# Altium schematic sheet address_LEDs.SchDoc
size A4; SheetNumber: 3; SheetTotal: 5
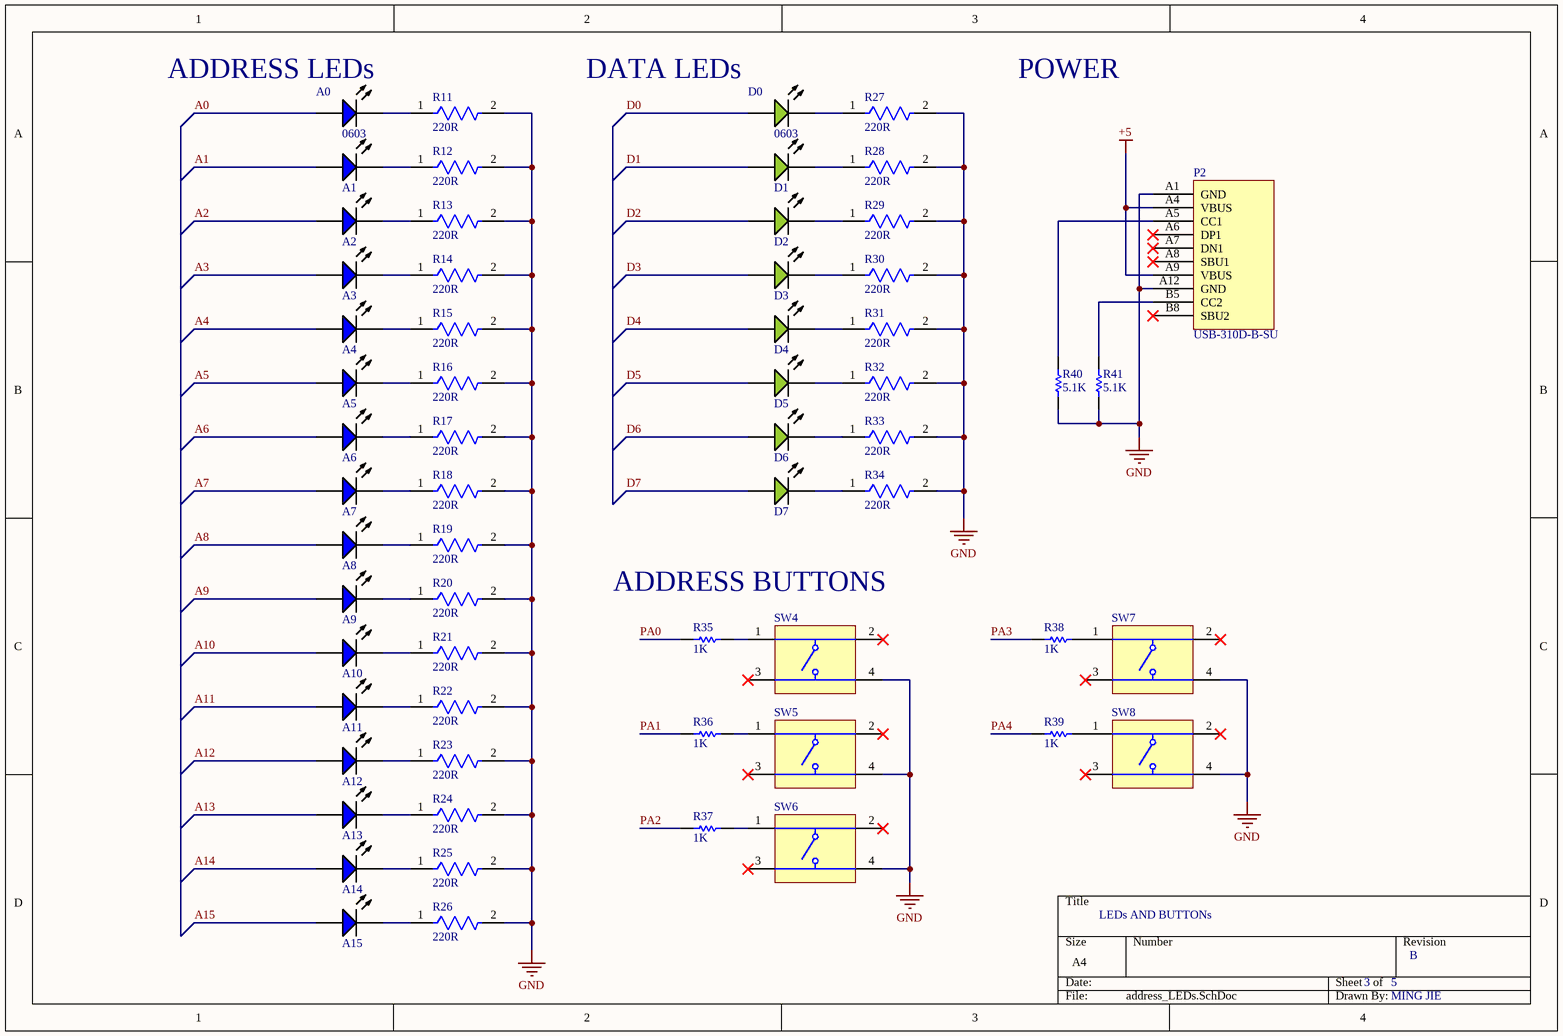
[diagram p0: address_LEDs.SchDoc]

## Parts
A0  Package Reference: 0603  [EVRL-0603-2_V]  (hidden comment: 19-217/BHC-ZL1M2RY/3T)
A1  19-217/BHC-ZL1M2RY/3T  [EVRL-0603-2_V]  (value not drawn)
A2  19-217/BHC-ZL1M2RY/3T  [EVRL-0603-2_V]  (value not drawn)
A3  19-217/BHC-ZL1M2RY/3T  [EVRL-0603-2_V]  (value not drawn)
A4  19-217/BHC-ZL1M2RY/3T  [EVRL-0603-2_V]  (value not drawn)
A5  19-217/BHC-ZL1M2RY/3T  [EVRL-0603-2_V]  (value not drawn)
A6  19-217/BHC-ZL1M2RY/3T  [EVRL-0603-2_V]  (value not drawn)
A7  19-217/BHC-ZL1M2RY/3T  [EVRL-0603-2_V]  (value not drawn)
A8  19-217/BHC-ZL1M2RY/3T  [EVRL-0603-2_V]  (value not drawn)
A9  19-217/BHC-ZL1M2RY/3T  [EVRL-0603-2_V]  (value not drawn)
A10  19-217/BHC-ZL1M2RY/3T  [EVRL-0603-2_V]  (value not drawn)
A11  19-217/BHC-ZL1M2RY/3T  [EVRL-0603-2_V]  (value not drawn)
A12  19-217/BHC-ZL1M2RY/3T  [EVRL-0603-2_V]  (value not drawn)
A13  19-217/BHC-ZL1M2RY/3T  [EVRL-0603-2_V]  (value not drawn)
A14  19-217/BHC-ZL1M2RY/3T  [EVRL-0603-2_V]  (value not drawn)
A15  19-217/BHC-ZL1M2RY/3T  [EVRL-0603-2_V]  (value not drawn)
D0  Package Reference: 0603  [EVRL-0603-2_V]  (hidden comment: 19-217/GHC-YR1S2/3T)
D1  19-217/GHC-YR1S2/3T  [EVRL-0603-2_V]  (value not drawn)
D2  19-217/GHC-YR1S2/3T  [EVRL-0603-2_V]  (value not drawn)
D3  19-217/GHC-YR1S2/3T  [EVRL-0603-2_V]  (value not drawn)
D4  19-217/GHC-YR1S2/3T  [EVRL-0603-2_V]  (value not drawn)
D5  19-217/GHC-YR1S2/3T  [EVRL-0603-2_V]  (value not drawn)
D6  19-217/GHC-YR1S2/3T  [EVRL-0603-2_V]  (value not drawn)
D7  19-217/GHC-YR1S2/3T  [EVRL-0603-2_V]  (value not drawn)
P2  USB-310D-B-SU  [USB-C-THT]
R11  Resistance: 220R  [FP-CRCW0805-e3-MFG]  (hidden comment: CRCW0805220RFKEA)
R12  Resistance: 220R  [FP-CRCW0805-e3-MFG]  (hidden comment: CRCW0805220RFKEA)
R13  Resistance: 220R  [FP-CRCW0805-e3-MFG]  (hidden comment: CRCW0805220RFKEA)
R14  Resistance: 220R  [FP-CRCW0805-e3-MFG]  (hidden comment: CRCW0805220RFKEA)
R15  Resistance: 220R  [FP-CRCW0805-e3-MFG]  (hidden comment: CRCW0805220RFKEA)
R16  Resistance: 220R  [FP-CRCW0805-e3-MFG]  (hidden comment: CRCW0805220RFKEA)
R17  Resistance: 220R  [FP-CRCW0805-e3-MFG]  (hidden comment: CRCW0805220RFKEA)
R18  Resistance: 220R  [FP-CRCW0805-e3-MFG]  (hidden comment: CRCW0805220RFKEA)
R19  Resistance: 220R  [FP-CRCW0805-e3-MFG]  (hidden comment: CRCW0805220RFKEA)
R20  Resistance: 220R  [FP-CRCW0805-e3-MFG]  (hidden comment: CRCW0805220RFKEA)
R21  Resistance: 220R  [FP-CRCW0805-e3-MFG]  (hidden comment: CRCW0805220RFKEA)
R22  Resistance: 220R  [FP-CRCW0805-e3-MFG]  (hidden comment: CRCW0805220RFKEA)
R23  Resistance: 220R  [FP-CRCW0805-e3-MFG]  (hidden comment: CRCW0805220RFKEA)
R24  Resistance: 220R  [FP-CRCW0805-e3-MFG]  (hidden comment: CRCW0805220RFKEA)
R25  Resistance: 220R  [FP-CRCW0805-e3-MFG]  (hidden comment: CRCW0805220RFKEA)
R26  Resistance: 220R  [FP-CRCW0805-e3-MFG]  (hidden comment: CRCW0805220RFKEA)
R27  Resistance: 220R  [FP-CRCW0805-e3-MFG]  (hidden comment: CRCW0805220RFKEA)
R28  Resistance: 220R  [FP-CRCW0805-e3-MFG]  (hidden comment: CRCW0805220RFKEA)
R29  Resistance: 220R  [FP-CRCW0805-e3-MFG]  (hidden comment: CRCW0805220RFKEA)
R30  Resistance: 220R  [FP-CRCW0805-e3-MFG]  (hidden comment: CRCW0805220RFKEA)
R31  Resistance: 220R  [FP-CRCW0805-e3-MFG]  (hidden comment: CRCW0805220RFKEA)
R32  Resistance: 220R  [FP-CRCW0805-e3-MFG]  (hidden comment: CRCW0805220RFKEA)
R33  Resistance: 220R  [FP-CRCW0805-e3-MFG]  (hidden comment: CRCW0805220RFKEA)
R34  Resistance: 220R  [FP-CRCW0805-e3-MFG]  (hidden comment: CRCW0805220RFKEA)
R35  Resistance: 1K  [RESC2013X50X30NL20T20]  (hidden comment: CRCW08051K00FKEA)
R36  Resistance: 1K  [RESC2013X50X30NL20T20]  (hidden comment: CRCW08051K00FKEA)
R37  Resistance: 1K  [RESC2013X50X30NL20T20]  (hidden comment: CRCW08051K00FKEA)
R38  Resistance: 1K  [RESC2013X50X30NL20T20]  (hidden comment: CRCW08051K00FKEA)
R39  Resistance: 1K  [RESC2013X50X30NL20T20]  (hidden comment: CRCW08051K00FKEA)
R40  Resistance: 5.1K  [RESC2013X50X30NL20T20]  (hidden comment: 0805W8F5101T5E)
R41  Resistance: 5.1K  [RESC2013X50X30NL20T20]  (hidden comment: 0805W8F5101T5E)
SW4  K2-1102SP-C4SC-04  [TECO-FSM4JSMA_V]  (value not drawn)
SW5  K2-1102SP-C4SC-04  [TECO-FSM4JSMA_V]  (value not drawn)
SW6  K2-1102SP-C4SC-04  [TECO-FSM4JSMA_V]  (value not drawn)
SW7  K2-1102SP-C4SC-04  [TECO-FSM4JSMA_V]  (value not drawn)
SW8  K2-1102SP-C4SC-04  [TECO-FSM4JSMA_V]  (value not drawn)

## Nets
+5: P2.A4(VBUS) P2.A9(VBUS)
GND: P2.A1(GND) P2.A12(GND) R11.2 R12.2 R13.2 R14.2 R15.2 R16.2 R17.2 R18.2 R19.2 R20.2 R21.2 R22.2 R23.2 R24.2 R25.2 R26.2 R27.2 R28.2 R29.2 R30.2 R31.2 R32.2 R33.2 R34.2 R40.1 R41.1 SW4.4 SW5.4 SW6.4 SW7.4 SW8.4
A0: A0.1(A)
A1: A1.1(A)
A2: A2.1(A)
A3: A3.1(A)
A4: A4.1(A)
A5: A5.1(A)
A6: A6.1(A)
A7: A7.1(A)
A8: A8.1(A)
A9: A9.1(A)
A10: A10.1(A)
A11: A11.1(A)
A12: A12.1(A)
A13: A13.1(A)
A14: A14.1(A)
A15: A15.1(A)
D0: D0.1(A)
D1: D1.1(A)
D2: D2.1(A)
D3: D3.1(A)
D4: D4.1(A)
D5: D5.1(A)
D6: D6.1(A)
D7: D7.1(A)
PA0: R35.1
PA1: R36.1
PA2: R37.1
PA3: R38.1
PA4: R39.1
NetA0_2: A0.2(K) R11.1
NetA1_2: A1.2(K) R12.1
NetA2_2: A2.2(K) R13.1
NetA3_2: A3.2(K) R14.1
NetA4_2: A4.2(K) R15.1
NetA5_2: A5.2(K) R16.1
NetA6_2: A6.2(K) R17.1
NetA7_2: A7.2(K) R18.1
NetA8_2: A8.2(K) R19.1
NetA9_2: A9.2(K) R20.1
NetA10_2: A10.2(K) R21.1
NetA11_2: A11.2(K) R22.1
NetA12_2: A12.2(K) R23.1
NetA13_2: A13.2(K) R24.1
NetA14_2: A14.2(K) R25.1
NetA15_2: A15.2(K) R26.1
NetD0_2: D0.2(K) R27.1
NetD1_2: D1.2(K) R28.1
NetD2_2: D2.2(K) R29.1
NetD3_2: D3.2(K) R30.1
NetD4_2: D4.2(K) R31.1
NetD5_2: D5.2(K) R32.1
NetD6_2: D6.2(K) R33.1
NetD7_2: D7.2(K) R34.1
NetP2_A5: P2.A5(CC1) R40.2
NetP2_B5: P2.B5(CC2) R41.2
NetR35_2: R35.2 SW4.1
NetR36_2: R36.2 SW5.1
NetR37_2: R37.2 SW6.1
NetR38_2: R38.2 SW7.1
NetR39_2: R39.2 SW8.1

Not connected (* = marked no-connect by the designer): P2 A6(DP1)* A7(DN1)* A8(SBU1)* B8(SBU2)*; SW4 2* 3*; SW5 2* 3*; SW6 2* 3*; SW7 2* 3*; SW8 2* 3*

## Notes on the sheet
- (near A0) ADDRESS LEDs
- DATA LEDs
- POWER
- ADDRESS BUTTONS
- LEDs AND BUTTONs
- 3
- 5
- B
- MING JIE

## Library data of the parts
A0-A15 = CMP-2100-03577-1: Chip LED, Blue, 5 V, 25 mA, -40 to 85 degC, 2-Pin SMD (0603), RoHS, Tape and Reel; Manufacturer: Everlight Electronics; Test Current: 20mA; Number of LEDs: 1; Luminous Intensity: 28.5mcd; Lens Style: Rectangular; Forward Current: 25mA; Power Dissipation: 110W; Forward Voltage: 3V; Viewing Angle: 120degrees; Dominant Wavelength: 470nm; Max Operating Temperature: 85degC; Mount: SurfaceMount; Package Description: 2-Pin Surface Mount Device, Body 1.6 x 0.8 mm; Depth: 0.8mm; Packaging: TapeandReel; Length: 1.6mm; Radiation Hardening: No; Colour: Blue; Datasheet Version: Rev. 1.0, 03/2003; Min Operating Temperature: -40degC; Number of Elements: 1; Manufacturer URL: http://www.everlight.com/; Datasheet URL: https://datasheet.ciiva.com/26901/getdatasheetpartid-420616-26901324.pdf; Case/Package: SMD/SMT; Lead Free: LeadFree; RoHSCompliant: true; Number of Pins: 2
  A1-A15: Package Reference: 0603
D0-D7 = CMP-2100-03580-1: Green 520~535nm 0603 Light Emitting Diodes (LED) RoHS; Manufacturer: Everlight Electronics; Lens Style: Rectangular; Forward Voltage: 2V; Number of LEDs: 1; Viewing Angle: 120degrees; Colour: Green; RoHSCompliant: true; Datasheet URL: https://datasheet.ciiva.com/48679/19-217-g7c-an1p2-3t-48679179.pdf; Manufacturer URL: http://www.everlight.com/; Package Description: 2-Pin Surface Mount Device, Body 1.6 x 0.8 mm; Datasheet Version: Rev. 1, 04/2006; Mount: SurfaceMount; Lead Free: LeadFree; Number of Pins: 2
  D1-D7: Package Reference: 0603
P2 = USB-310D-B-SU: USB Type C Receptacle
R11-R34 = CMP-2001-03682-2: RES Thick Film, 220Ω, 1%, 0.125W, 100ppm/°C, 0805; Max Power Dissipation: 125mW; Voltage Rating: 150V; Packaging: Tape and Reel; Termination: SMD/SMT; Height: 0.45mm; Package Quantity: 10; Width: 0.049inch; Min Operating Temperature: -55°C; Lead Free: Lead Free; Military Standard: Not; Mount: Surface Mount; Max Operating Temperature: 155°C; Voltage Rating (DC): 150V; Composition: Thick Film; Case/Package: 0805; Length: 2mm; Weight: 0.000194oz; Case Code (Metric): 2012; Number of Terminations: 2; Case Code (Imperial): 0805; Radiation Hardening: No; Tolerance: 1%; Features: Automotive AEC-Q200; Power Rating: 125mW; Depth: 1.25mm; Contact Plating: Tin; Temperature Coefficient: 100ppm/°C
R35-R39 = CMP-1013-00510-2: Manufacturer: Vishay Dale; Part Number: CRCW08051K00FKEA
R40 R41 = CMP-1013-00510-2: 5.1kΩ ±1% 0.125W ±100ppm/℃ 0805 Chip Resistor - Surface Mount RoHS; Manufacturer: UniOhm; Part Number: 0805W8F5101T5E
SW4-SW8 = CMP-2000-05602-2: Swicth, SPST, 24 V, -35 to 85 degC, 4-Pin SMD, RoHS, Tape and Reel; Manufacturer: TE Connectivity; Switch Travel: 0.25mm; Mechanical Life: 100000Cycles; Contact Current Rating: 50mA; Operating Force: 1.57N; Actuator Material: Polyamide; Contact Resistance: 100mOhm; Voltage Rating: 24V; Illumination Type: Illuminated; Actuator Length: 0.055inch; Max Voltage Rating (DC): 12V; Case\/Package: SMD/SMT; Orientation: Straight; Datasheet URL: http://www.te.com/commerce/DocumentDelivery/DDEController?Action=showdoc&DocId=Customer+Drawing%7F2-1437565-7%7FV%7Fpdf%7FEnglish%7FENG_CD_2-1437565-7_V.pdf%7F4-1437565-2; Min Operating Temperature: -35degC; Packaging: LoosePiece; Termination: GullWing; Throw Configuration: SPST; Package Description: 4-Pin Surface Mount Device, Body 6 x 6 mm, Pitch 4.5 mm; Mounting Technology: SurfaceMount; Contact Plating: Silver; Datasheet Version: Rev. V, 02/2015; RoHSCompliant: true; Max Operating Temperature: 85degC; Length: 6mm; Voltage Rating (DC): 24V; Electrical Life: 100000Cycles; Current Rating: 50mA; Package Quantity: 750; Mount: SurfaceMount; Package Reference: FSM4JSMA; Manufacturer URL: http://www.te.com/; Width: 6mm; REACH SVHC: Unknown; Contact Material: CopperAlloy